# Altium schematic sheet Power Supply.SchDoc
size 381 x 241 mm
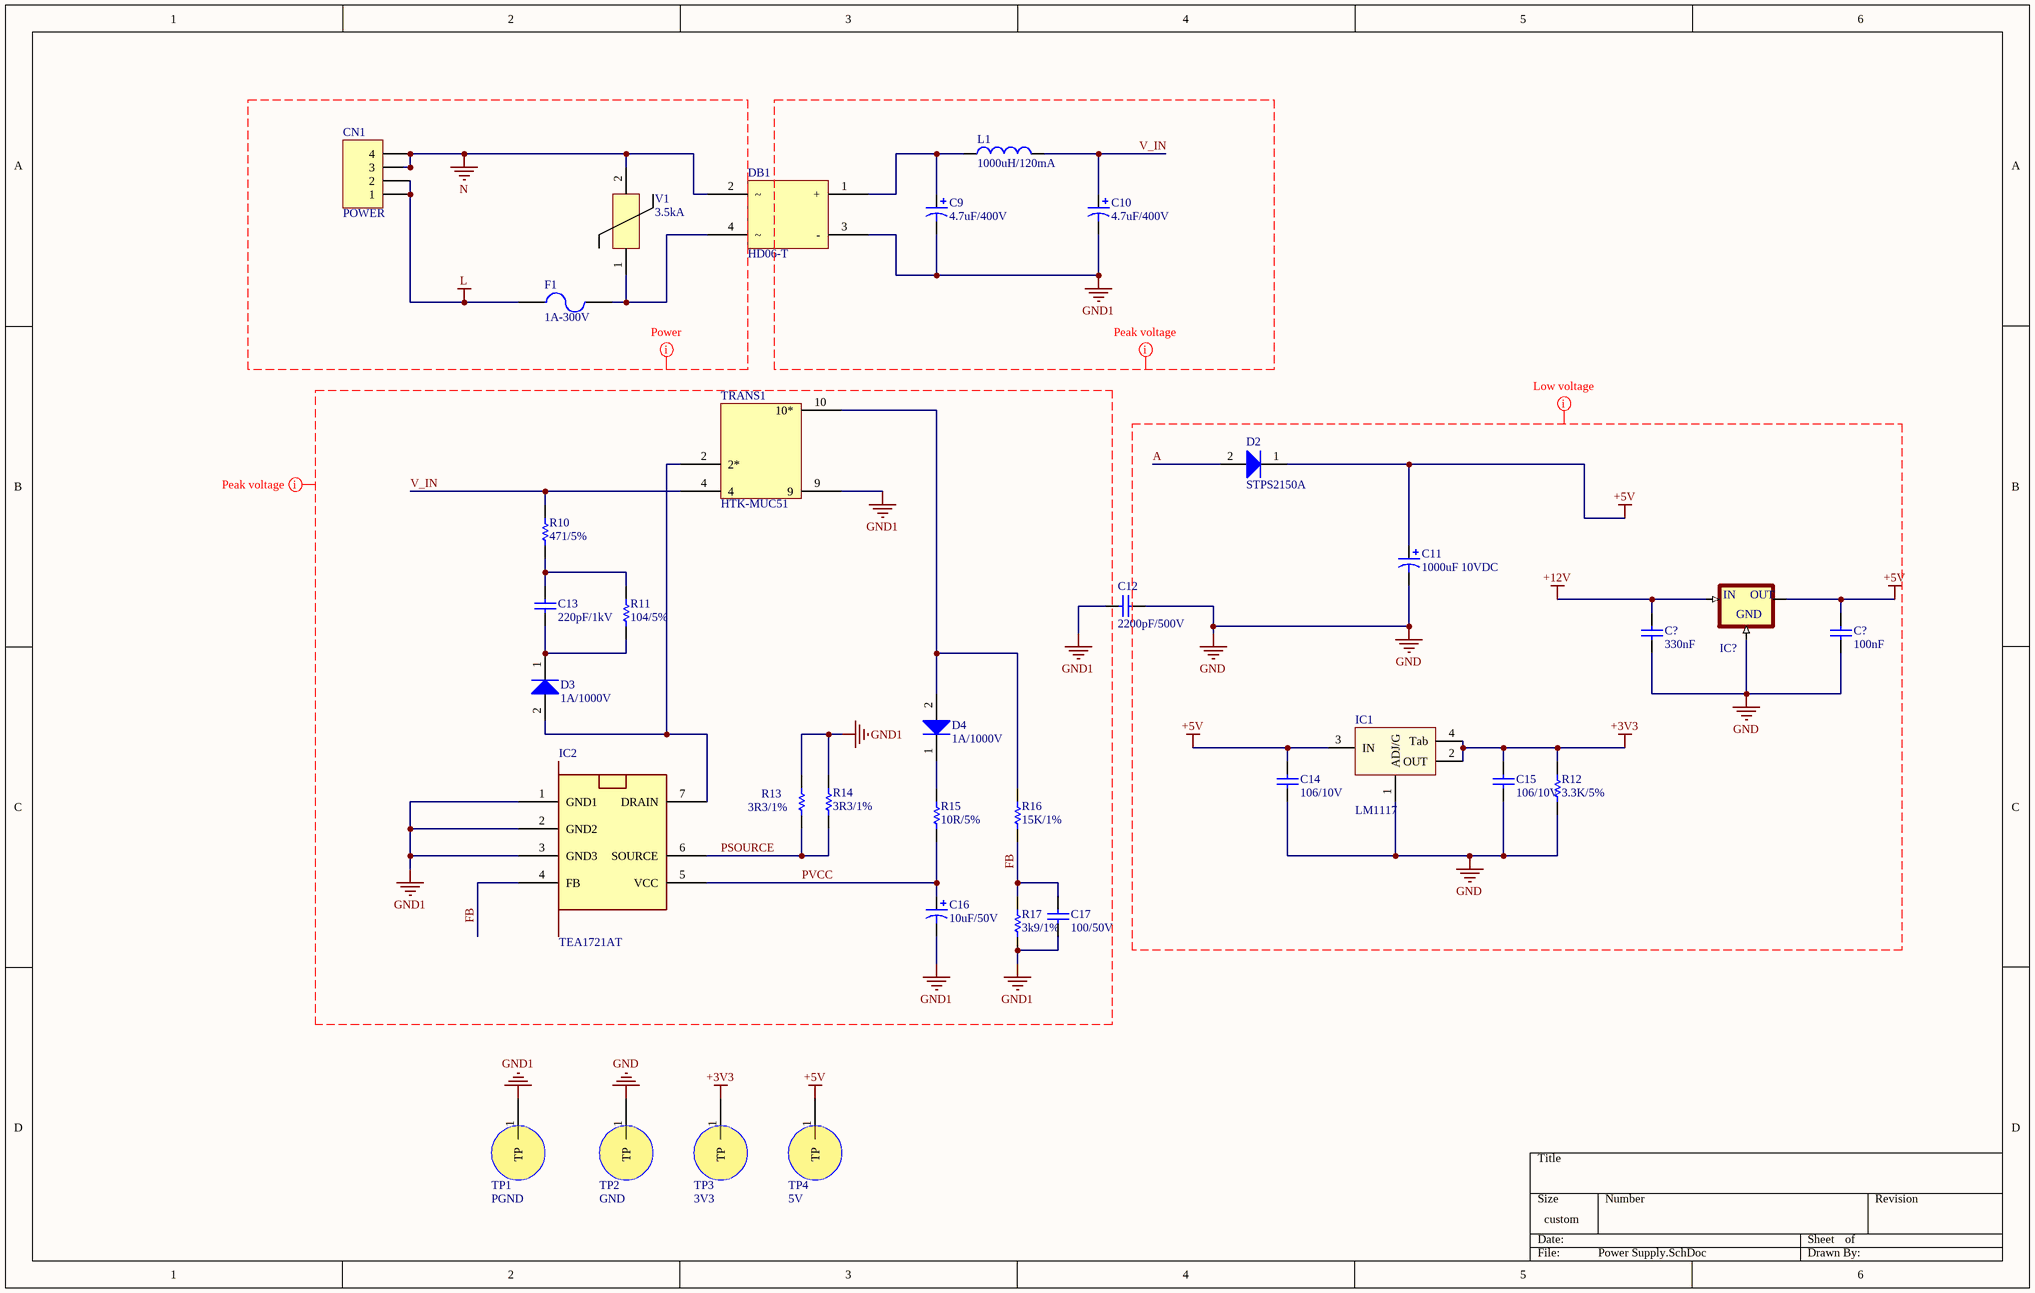
[diagram p0: Power Supply.SchDoc]

## Parts
(Parts that share a designator on the sheet are numbered #1, #2 ... from top to bottom, then left to right.)
C9  4.7uF/400V  [CAPPR3.5-8x11.5]
C10  4.7uF/400V  [CAPPR3.5-8x11.5]
C11  1000uF 10VDC  [CAPPR3.5-8x15A]
C12  2200pF/500V  [562R5TSD22]
C13  220pF/1kV  [F221K25Y5RN6UK5R]
C14  106/10V  [C0805-C]
C15  106/10V  [C0805-C]
C16  10uF/50V  [CAPPR2-5x11]
C17  100/50V  [C0603-C]
C?#1  330nF  [C0805-C]
C?#2  100nF  [C0805-C]
CN1  POWER  [H60200801000G]
D2  STPS2150A  [SMA]
D3  1A/1000V  [DO-214BA]
D4  1A/1000V  [DO-214BA]
DB1  HD06-T  [HD0X]
F1  1A-300V  [F36911000000]
IC1  LM1117  [SOT223-4N]
IC2  TEA1721AT  [SO-7]
IC?  78L05_TO252  [TO-263-3-A]  (value not drawn)
L1  1000uH/120mA  [RLB0812]
R10  471/5%  [R1206-C]
R11  104/5%  [R1206-C]
R12  3.3K/5%  [R0603-B]
R13  3R3/1%  [R1206-C]
R14  3R3/1%  [R1206-C]
R15  10R/5%  [R0603-B]
R16  15K/1%  [R0603-C]
R17  3k9/1%  [R0603-C]
TP1  PGND  [TP Multilayer]  (no BOM)
TP2  GND  [TP Multilayer]  (no BOM)
TP3  3V3  [TP Multilayer]  (no BOM)
TP4  5V  [TP Multilayer]  (no BOM)
TRANS1  HTK-MUC51  [HTK-MUC51]
V1  3.5kA  [V10E300P-H]

## Nets
+3V3: C15.2 IC1.2(OUT) IC1.4(Tab) R12.2 TP3.1(TP)
+5V: C11.1(+) C14.2 C?#2.2 D2.1(K) IC1.3(IN) IC?.3(OUT) TP4.1(TP)
+12V: C?#1.2 IC?.1(IN)
GND: C11.2(-) C12.2 C14.1 C15.1 C?#1.1 C?#2.1 IC1.1(ADJ/G) IC?.2(GND) R12.1 TP2.1(TP)
GND1: C9.2(-) C10.2(-) C12.1 C16.2(-) C17.1 DB1.3(-) IC2.1(GND1) IC2.2(GND2) IC2.3(GND3) R13.2 R14.2 R17.1 TP1.1(TP) TRANS1.9
L: CN1.1 CN1.2 F1.1
N: CN1.3 CN1.4 DB1.2 V1.2
A: D2.2(A)
FB: C17.2 IC2.4(FB) R16.1 R17.2
PSOURCE: IC2.6(SOURCE) R13.1 R14.1
PVCC: C16.1(+) IC2.5(VCC) R15.1
V_IN: C10.1(+) L1.2 R10.2 TRANS1.4
NetC9_1: C9.1(+) DB1.1(+) L1.1
NetC13_1: C13.1 D3.1(K) R11.1
NetC13_2: C13.2 R10.1 R11.2
NetD3_2: D3.2(A) IC2.7(DRAIN) TRANS1.2(2*)
NetD4_1: D4.1(K) R15.2
NetD4_2: D4.2(A) R16.2 TRANS1.10(10*)
NetDB1_4: DB1.4 F1.2 V1.1

## Layout directives
net class Peak voltage: FB, GND1, PSOURCE, PVCC, V_IN
net class Low voltage: +3V3, +5V, +12V, A, GND
net class Power: L, N

## Library data of the parts
C9 C10 = UVC2G4R7MPD: CAPP 4.7uF 400V 20%; BSH Partnumber: C-4.7-400-8x12; Manufacture: Nichicon; Pricing (USD): 0.196; Partnumber: UVC2G4R7MPD; Distributor: Mouser; Value: 4.7uF/400V; Creator: SmartDevice; Date: 20160610; ComponentLink1Description: Datasheet; ComponentLink1URL: http://www.mouser.com/ds/2/293/e-uvc-884169.pdf; Datasheet: http://www.mouser.com/ds/2/293/e-uvc-884169.pdf; ComponentLink2Description: Link sale; ComponentLink2URL: http://www.mouser.vn/ProductDetail/Nichicon/UVC2G4R7MPD/?qs=%2fha2pyFadugG8EgAuLk2FI4lDn3gTjIjspvzUlbO%2fdoUmPWf3U1vnw%3d%3d; Link sale: http://www.mouser.vn/ProductDetail/Nichicon/UVC2G4R7MPD/?qs=%2fha2pyFadugG8EgAuLk2FI4lDn3gTjIjspvzUlbO%2fdoUmPWf3U1vnw%3d%3d
C11 = EEU-FR1A102L: Aluminum Electrolytic Capacitors - Leaded 10VDC 1000uF 8x15mm LS3.5mm; BSH Partnumber: C-1000u-10V-20; Manufacture: Panasonic; Pricing (USD): 0; Partnumber: EEU-FR1A102L; Distributor: Mouser; Value: 1000uF 10VDC; Creator: NamNHc; Date: 20160709; ComponentLink1Description: Datasheet; ComponentLink1URL: http://www.mouser.com/ds/2/315/ABA0000C1021-947569.pdf; Datasheet: http://www.mouser.com/ds/2/315/ABA0000C1021-947569.pdf; ComponentLink2Description: Link sale; ComponentLink2URL: http://www.mouser.vn/ProductDetail/Panasonic/EEU-FR1A102L/?qs=sGAEpiMZZMtZ1n0r9vR22f2plZjWOZXTVY6dm5baXxU%3d; Link sale: http://www.mouser.vn/ProductDetail/Panasonic/EEU-FR1A102L/?qs=sGAEpiMZZMtZ1n0r9vR22f2plZjWOZXTVY6dm5baXxU%3d
C12 = 562R5TSD22: Ceramic Disc Capacitors 500volts 2200pF 10% .25LS X7R; BSH Partnumber: New part; Manufacture: Vishay / BC Components; Pricing (USD): 0.338; Partnumber: 562R5TSD22; Distributor: Mouser; Value: 2200pF/500V; Creator: NamNHc; Date: 20170329; ComponentLink1Description: Datasheet; ComponentLink1URL: http://www.mouser.com/ds/2/427/561r562r565r-239687.pdf; Datasheet: http://www.mouser.com/ds/2/427/561r562r565r-239687.pdf; ComponentLink2Description: Link sale; ComponentLink2URL: http://www.mouser.vn/ProductDetail/Vishay-Cera-Mite/562R5TSD22/?qs=sGAEpiMZZMt1mVBmZSXTPInczIyfF0EBuZvvR8HKRKI=; Link sale: http://www.mouser.vn/ProductDetail/Vishay-Cera-Mite/562R5TSD22/?qs=sGAEpiMZZMt1mVBmZSXTPInczIyfF0EBuZvvR8HKRKI=
C13 = F221K25Y5RN6UK5R: CAPP Ceramic Disc 220pF 1000V 10% 5x6.5mm; BSH Partnumber: C-220-1K-D; Manufacture: Vishay / BC Components; Pricing (USD): 0.129; Partnumber: F221K25Y5RN6UK5R; Distributor: Mouser; Value: 220pF/1kV; Creator: SmartDevice; Date: 20160716; ComponentLink1Description: Datasheet; ComponentLink1URL: http://www.mouser.com/ds/2/427/hvldf02-515169.pdf; Datasheet: http://www.mouser.com/ds/2/427/hvldf02-515169.pdf; ComponentLink2Description: Link sale; ComponentLink2URL: http://www.mouser.vn/ProductDetail/Vishay/F221K25Y5RN6UK5R/?qs=%2fha2pyFaduiH3AWr3oDgc4rr8ZI%252b6maFUN2U6TJgzO2VQGuikzFv0A%3d%3d; Link sale: http://www.mouser.vn/ProductDetail/Vishay/F221K25Y5RN6UK5R/?qs=%2fha2pyFaduiH3AWr3oDgc4rr8ZI%252b6maFUN2U6TJgzO2VQGuikzFv0A%3d%3d
C14 C15 = GRM21BR71A106KA73L: CAP 0805 10uF 10V 10%; BSH Partnumber: C-10u-10V-0805-10; Manufacture: Murata Electronics; Pricing (USD): 0.039; Partnumber: GRM21BR71A106KA73L; Distributor: Mouser; Value: 106/10V; Creator: SmartDevice; Date: 20160715; ComponentLink1Description: Datasheet; ComponentLink1URL: http://www.murata.com/products/catalog/pdf/c02e.pdf; Datasheet: http://www.murata.com/products/catalog/pdf/c02e.pdf; ComponentLink2Description: Link sale; ComponentLink2URL: http://www.mouser.vn/ProductDetail/Murata/GRM21BR71A106KA73L/?qs=%2fha2pyFaduh%2fEdsyu96AxlYmpb%2fkUgcA5NhpACNM6PnXP0Re01zvkhFjHxs1cDT4; Link sale: http://www.mouser.vn/ProductDetail/Murata/GRM21BR71A106KA73L/?qs=%2fha2pyFaduh%2fEdsyu96AxlYmpb%2fkUgcA5NhpACNM6PnXP0Re01zvkhFjHxs1cDT4
C16 = EEU-EB1H100S: CAPP 10uF 50V 20%; BSH Partnumber: C-10u-50-20-D; Manufacture: Panasonic; Pricing (USD): 0.072; Partnumber: EEU-EB1H100S; Distributor: Mouser; Value: 10uF/50V; Creator: SmartDevice; Date: 20160716; ComponentLink1Description: Datasheet; ComponentLink1URL: http://www.mouser.com/ds/2/315/DMF0000COL62-951366.pdf; Datasheet: http://www.mouser.com/ds/2/315/DMF0000COL62-951366.pdf; ComponentLink2Description: Link sale; ComponentLink2URL: http://www.mouser.vn/ProductDetail/Panasonic/EEU-EB1H100S/?qs=sGAEpiMZZMtZ1n0r9vR22RyzzjEKRzqKZbIP%252bqQ6oFI%3d; Link sale: http://www.mouser.vn/ProductDetail/Panasonic/EEU-EB1H100S/?qs=sGAEpiMZZMtZ1n0r9vR22RyzzjEKRzqKZbIP%252bqQ6oFI%3d
C17 = GRM1885C1H100JA01D: CAP 0603 10pF 5% 50V; BSH Partnumber: C-100-50-0603-5; Manufacture: Murata Electronics; Pricing (USD): 0.01; Partnumber: GRM1885C1H100JA01D; Distributor: Mouser; Value: 100/50V; Creator: SmartDevice; Date: 20160715; ComponentLink1Description: Datasheet; ComponentLink1URL: http://www.murata.com/products/catalog/pdf/c02e.pdf; Datasheet: http://www.murata.com/products/catalog/pdf/c02e.pdf; ComponentLink2Description: Link sale; ComponentLink2URL: http://www.mouser.vn/ProductDetail/Murata/GRM1885C1H100JA01D/?qs=%2fha2pyFadug%2fvrC4VCXnlbJmrOFMaxj30QUgA6YXUVlxuM%2fhvX8xlA%3d%3d; Link sale: http://www.mouser.vn/ProductDetail/Murata/GRM1885C1H100JA01D/?qs=%2fha2pyFadug%2fvrC4VCXnlbJmrOFMaxj30QUgA6YXUVlxuM%2fhvX8xlA%3d%3d
C?#1 C?#2 = GRM21BR71A106KA73L: CAP 0805 10uF 10V 10%; BSH Partnumber: C-10u-10V-0805-10; Manufacture: Murata Electronics; Value: 106/10V; Pricing (USD): 0.039; Partnumber: GRM21BR71A106KA73L; Distributor: Mouser; Creator: SmartDevice; Date: 20160715; ComponentLink1Description: Datasheet; ComponentLink1URL: http://www.murata.com/products/catalog/pdf/c02e.pdf; Datasheet: http://www.murata.com/products/catalog/pdf/c02e.pdf; ComponentLink2Description: Link sale; ComponentLink2URL: http://www.mouser.vn/ProductDetail/Murata/GRM21BR71A106KA73L/?qs=%2fha2pyFaduh%2fEdsyu96AxlYmpb%2fkUgcA5NhpACNM6PnXP0Re01zvkhFjHxs1cDT4; Link sale: http://www.mouser.vn/ProductDetail/Murata/GRM21BR71A106KA73L/?qs=%2fha2pyFaduh%2fEdsyu96AxlYmpb%2fkUgcA5NhpACNM6PnXP0Re01zvkhFjHxs1cDT4
CN1 = H60200801000G: CON H60200801000G 4P Male; BSH Partnumber: CN-H60200801000G; Manufacture: ANYTEK; Value: CON-4; Partnumber: H60200801000G; Creator: SmartDevice; Date: 20160715; ComponentLink1Description: Datasheet; ComponentLink1URL: http://www.anytek.com.tw/UserUpFiles/20120827/QEmQqqk9rR3n.pdf; Datasheet: http://www.anytek.com.tw/UserUpFiles/20120827/QEmQqqk9rR3n.pdf; ComponentLink2Description: Link sale; ComponentLink2URL: http://www.anytek.com.tw/EN/search_product.aspx?cateid=&codename=&exflag1=0&exflag5=60200801000G&page=1; Link sale: http://www.anytek.com.tw/EN/search_product.aspx?cateid=&codename=&exflag1=0&exflag5=60200801000G&page=1
D2 = STPS2150A: DIODE SMA 2.0A 150V 2.95x4.6x2.03mm; BSH Partnumber: D-STPS2150A; Manufacture: STMicroelectronics; Pricing (USD): 0.155; Partnumber: STPS2150A; Distributor: Mouser; Value: STPS2150A; Creator: SmartDevice; Date: 20160610; ComponentLink1Description: Datasheet; ComponentLink1URL: http://www.mouser.com/ds/2/389/CD00003322-250509.pdf; Datasheet: http://www.mouser.com/ds/2/389/CD00003322-250509.pdf; ComponentLink2Description: Link sale; ComponentLink2URL: http://www.mouser.vn/ProductDetail/STMicroelectronics/STPS2150A/?qs=%2fha2pyFadugOUJO7vR3gGVErv5AK1AyP3XR3TiacJmw%3d; Link sale: http://www.mouser.vn/ProductDetail/STMicroelectronics/STPS2150A/?qs=%2fha2pyFadugOUJO7vR3gGVErv5AK1AyP3XR3TiacJmw%3d
D3 D4 = GF1M-E3/67A: DIODE DO-214AB 1000V 1A; BSH Partnumber: D-GF1M; Manufacture: Vishay Semiconductors; Pricing (USD): 0.187; Partnumber: GF1M-E3/67A; Distributor: Mouser; Value: 1A/1000V; Creator: SmartDevice; Date: 20151022; ComponentLink1Description: Datasheet; ComponentLink1URL: http://www.mouser.com/ds/2/427/gf1-240444.pdf; Datasheet: http://www.mouser.com/ds/2/427/gf1-240444.pdf; ComponentLink2Description: Link sale; ComponentLink2URL: http://vn.mouser.com/ProductDetail/Vishay-Semiconductors/GF1M-E3-67A/?qs=AvlKB63p5SmLpodxku2zLQ%3D%3D; Link sale: http://vn.mouser.com/ProductDetail/Vishay-Semiconductors/GF1M-E3-67A/?qs=AvlKB63p5SmLpodxku2zLQ%3D%3D
DB1 = HD06-T: DB SMD 0.8A 600V; BSH Partnumber: D-HD06-T; Manufacture: Diodes Incorporated; Pricing (USD): 0.151; Partnumber: HD06-T; Distributor: Mouser; Value: HD06-T; Creator: SmartDevice; Date: 20160704; ComponentLink1Description: Datasheet; ComponentLink1URL: http://www.mouser.com/ds/2/115/ds17003-38038.pdf; Datasheet: http://www.mouser.com/ds/2/115/ds17003-38038.pdf; ComponentLink2Description: Link sale; ComponentLink2URL: http://www.mouser.vn/ProductDetail/Diodes-Incorporated/HD06-T/?qs=sGAEpiMZZMtQ8nqTKtFS%2fNgL6ac11fJuElzuDV0ZOyo%3d; Link sale: http://www.mouser.vn/ProductDetail/Diodes-Incorporated/HD06-T/?qs=sGAEpiMZZMtQ8nqTKtFS%2fNgL6ac11fJuElzuDV0ZOyo%3d
F1 = 36911000000: FUSE 36911000000 1A 300V 4x8mm; BSH Partnumber: F-1A-300V; Manufacture: Little Fuse; Pricing (USD): 0.212; Partnumber: 36911000000; Distributor: Mouser; Value: 1A-300V; Creator: SmartDevice; Date: 20160611; ComponentLink1Description: Datasheet; ComponentLink1URL: http://www.mouser.com/ds/2/240/Littelfuse_Fuse_369_Datasheet.pdf-693406.pdf; Datasheet: http://www.mouser.com/ds/2/240/Littelfuse_Fuse_369_Datasheet.pdf-693406.pdf; ComponentLink2Description: Link sale; ComponentLink2URL: http://www.mouser.vn/ProductDetail/Littelfuse/36911000000/?qs=%2fha2pyFadugel56iQkHFpKBlKzqe72eQ8PsAjO18UxxK9Xd8%252bW4Qpg%3d%3d; Link sale: http://www.mouser.vn/ProductDetail/Littelfuse/36911000000/?qs=%2fha2pyFadugel56iQkHFpKBlKzqe72eQ8PsAjO18UxxK9Xd8%252bW4Qpg%3d%3d
IC1 = LM1117: 3v3; Value: LM317
IC2 = TEA1721AT/N1,118: IC AC/DC Converter SO-7 5.0x6.2x1.75mm; BSH Partnumber: IC-TEA1721AT/N1,118; Manufacture: NXP; Pricing (USD): 1; Partnumber: TEA1721AT/N1,118; Distributor: Mouser; Value: TEA1721AT; Creator: SmartDevice; Date: 20160611; ComponentLink1Description: Datasheet; ComponentLink1URL: http://www.mouser.com/ds/2/302/TEA1721AT-843077.pdf; Datasheet: http://www.mouser.com/ds/2/302/TEA1721AT-843077.pdf; ComponentLink2Description: Link sale; ComponentLink2URL: http://www.mouser.vn/ProductDetail/NXP/TEA1721AT-N1118/?qs=%2fha2pyFadujS%2fIwLEty%2falDzm3J8%2fJUNkB0iVdfNz8M%3d; Link sale: http://www.mouser.vn/ProductDetail/NXP/TEA1721AT-N1118/?qs=%2fha2pyFadujS%2fIwLEty%2falDzm3J8%2fJUNkB0iVdfNz8M%3d
IC? = 78L05_TO252: 78L05
L1 = RLB0812-102KL: IND  1000uH 10% 0.12A; BSH Partnumber: L-RLB0812-102KL; Manufacture: Bourns; Pricing (USD): 0.116; Partnumber: RLB0812-102KL; Distributor: Mouser; Value: 1000uH/120mA; Creator: SmartDevice; Date: 20160707; ComponentLink1Description: Datasheet; ComponentLink1URL: http://www.mouser.com/ds/2/54/LB-777833.pdf; Datasheet: http://www.mouser.com/ds/2/54/LB-777833.pdf; ComponentLink2Description: Link sale; ComponentLink2URL: http://www.mouser.vn/ProductDetail/Bourns/RLB0812-102KL/?qs=%2fha2pyFadugUXycZP3hAKbNHRNMcV3vYTNoRX6lu328P8PrVdgjsIA%3d%3d; Link sale: http://www.mouser.vn/ProductDetail/Bourns/RLB0812-102KL/?qs=%2fha2pyFadugUXycZP3hAKbNHRNMcV3vYTNoRX6lu328P8PrVdgjsIA%3d%3d
R10 = RC1206JR-07470RL: RES 1206 470R 5% 250mW; BSH Partnumber: R-470R-1206-5; Manufacture: Yageo; Pricing (USD): 0.004; Partnumber: RC1206JR-07470RL; Distributor: Mouser; Value: 471/5%; Creator: SmartDevice; Date: 20160716; ComponentLink1Description: Datasheet; ComponentLink1URL: http://www.mouser.com/ds/2/447/PYu-RC1206_51_RoHS_L-4-349080.pdf; Datasheet: http://www.mouser.com/ds/2/447/PYu-RC1206_51_RoHS_L-4-349080.pdf; ComponentLink2Description: Link sale; ComponentLink2URL: http://www.mouser.vn/ProductDetail/Yageo/RC1206JR-07470RL/?qs=%2fha2pyFadugAv10W5eASAinpIUt6qtrVv1pLdKpZoto0rQMznlyYjg%3d%3d; Link sale: http://www.mouser.vn/ProductDetail/Yageo/RC1206JR-07470RL/?qs=%2fha2pyFadugAv10W5eASAinpIUt6qtrVv1pLdKpZoto0rQMznlyYjg%3d%3d
R11 = RC1206JR-07100KL: RES 1206 100K 5% 250mW; BSH Partnumber: R-100K-1206-5; Manufacture: Yageo; Pricing (USD): 0.004; Partnumber: RC1206JR-07100KL; Distributor: Mouser; Value: 104/5%; Creator: SmartDevice; Date: 20160716; ComponentLink1Description: Datasheet; ComponentLink1URL: http://www.mouser.com/ds/2/447/PYu-RC1206_51_RoHS_L-4-349080.pdf; Datasheet: http://www.mouser.com/ds/2/447/PYu-RC1206_51_RoHS_L-4-349080.pdf; ComponentLink2Description: Link sale; ComponentLink2URL: http://www.mouser.vn/ProductDetail/Yageo/RC1206JR-07100KL/?qs=%2fha2pyFadugAv10W5eASAgAbIwDj0mC5zdBHJsZxIFkHK6MBmZ2tew%3d%3d; Link sale: http://www.mouser.vn/ProductDetail/Yageo/RC1206JR-07100KL/?qs=%2fha2pyFadugAv10W5eASAgAbIwDj0mC5zdBHJsZxIFkHK6MBmZ2tew%3d%3d
R12 = RC0603JR-073K3L: RES 0603 3.3K 5% 100mW; BSH Partnumber: R-3K3-0603-5; Manufacture: Yageo; Pricing (USD): 0.002; Partnumber: RC0603JR-073K3L; Distributor: Mouser; Value: 3.3K/5%; Creator: SmartDevice; Date: 20160716; ComponentLink1Description: Datasheet; ComponentLink1URL: http://www.mouser.com/ds/2/447/RC0603-272842.pdf; Datasheet: http://www.mouser.com/ds/2/447/RC0603-272842.pdf; ComponentLink2Description: Link sale; ComponentLink2URL: http://www.mouser.vn/ProductDetail/Yageo/RC0603JR-073K3L/?qs=%2fha2pyFaduiI%252b%2f%2fp%2fYhTTUC9G%2ftM89tiss13Vr5bentGgwH5efyYUg%3d%3d; Link sale: http://www.mouser.vn/ProductDetail/Yageo/RC0603JR-073K3L/?qs=%2fha2pyFaduiI%252b%2f%2fp%2fYhTTUC9G%2ftM89tiss13Vr5bentGgwH5efyYUg%3d%3d
R13 R14 = RC1206FR-073R3L: RES 1206 3R3 1% 250mW; BSH Partnumber: R-3R3-1206-1; Manufacture: Yageo; Pricing (USD): 0.009; Partnumber: RC1206FR-073R3L; Distributor: Mouser; Value: 3R3/1%; Creator: SmartDevice; Date: 20160716; ComponentLink1Description: Datasheet; ComponentLink1URL: http://www.mouser.com/ds/2/447/PYu-RC1206_51_RoHS_L-4-349080.pdf; Datasheet: http://www.mouser.com/ds/2/447/PYu-RC1206_51_RoHS_L-4-349080.pdf; ComponentLink2Description: Link sale; ComponentLink2URL: http://www.mouser.vn/ProductDetail/Yageo/RC1206FR-073R3L/?qs=%2fha2pyFaduhRUg1%252bSfBETOq42wV2vAUJY3MnS0bXa6FiCpwrrcH8OQ%3d%3d; Link sale: http://www.mouser.vn/ProductDetail/Yageo/RC1206FR-073R3L/?qs=%2fha2pyFaduhRUg1%252bSfBETOq42wV2vAUJY3MnS0bXa6FiCpwrrcH8OQ%3d%3d
R15 = RC0603JR-0710RL: RES 0603 10R 5% 100mW; BSH Partnumber: R-10R-0603-5; Manufacture: Yageo; Pricing (USD): 0.002; Partnumber: RC0603JR-0710RL; Distributor: Mouser; Value: 10R/5%; Creator: SmartDevice; Date: 20150818; ComponentLink1Description: Datasheet; ComponentLink1URL: http://www.mouser.com/ds/2/447/RC0603-272842.pdf; Datasheet: http://www.mouser.com/ds/2/447/RC0603-272842.pdf; ComponentLink2Description: Link sale; ComponentLink2URL: http://vn.mouser.com/ProductDetail/Yageo/RC0603JR-0710RL/?qs=sGAEpiMZZMu61qfTUdNhG5eFuApKbqVd7N2n6WR6Q2s%3d; Link sale: http://vn.mouser.com/ProductDetail/Yageo/RC0603JR-0710RL/?qs=sGAEpiMZZMu61qfTUdNhG5eFuApKbqVd7N2n6WR6Q2s%3d
R16 = RC0603FR-0715KL: RES 0603 15k 1% 100mW; BSH Partnumber: R-15K-0603-1; Manufacture: Yageo; Pricing (USD): 0.002; Partnumber: RC0603FR-0715KL; Distributor: Mouser; Value: 15K/1%; Creator: SmartDevice; Date: 20160716; ComponentLink1Description: Datasheet; ComponentLink1URL: http://www.mouser.com/ds/2/447/RC0603-272842.pdf; Datasheet: http://www.mouser.com/ds/2/447/RC0603-272842.pdf; ComponentLink2Description: Link sale; ComponentLink2URL: http://www.mouser.vn/ProductDetail/Yageo/RC0603FR-0715KL/?qs=%2fha2pyFaduhXXNW8qwNUNlRLrWlOrSb86bYDLRXgp06KHZvTB0LjtA%3d%3d; Link sale: http://www.mouser.vn/ProductDetail/Yageo/RC0603FR-0715KL/?qs=%2fha2pyFaduhXXNW8qwNUNlRLrWlOrSb86bYDLRXgp06KHZvTB0LjtA%3d%3d
R17 = RC0603FR-073K9L: RES 0603 3K9 1% 100mW; BSH Partnumber: R-3K9-0603-1; Manufacture: Yageo; Pricing (USD): 0.0013; Partnumber: RC0603FR-073K9L; Distributor: Digikey; Value: 3k9/1%; Creator: SmartDevice; Date: 20160714; ComponentLink1Description: Datasheet; ComponentLink1URL: http://www.yageo.com.tw/exep/pages/download/literatures/PYu-R_INT-thick_7.pdf; Datasheet: http://www.yageo.com.tw/exep/pages/download/literatures/PYu-R_INT-thick_7.pdf; ComponentLink2Description: Link sale; ComponentLink2URL: http://www.digikey.com/product-detail/en/yageo/RC0603FR-073K9L/311-3.90KHRTR-ND/727136; Link sale: http://www.digikey.com/product-detail/en/yageo/RC0603FR-073K9L/311-3.90KHRTR-ND/727136
TP1-TP4 = TP1: Test Point Multilayer; Partnumber: TP1; Value: TP Multilayer; BSH Partnumber: TP; Creator: DucNTc; Date: 20150912; ComponentLink1Description: Datasheet; ComponentLink2Description: Link sale
TRANS1 = HTK-MUC51: Transformer 5V/1A Power; BSH Partnumber: T-HTK-MUC51; Manufacture: Tabuchi electric; Value: TRANS; Pricing (USD): 2; Partnumber: HTK-MUC51; Distributor: Tabuchi Viet Nam; Creator: NamNHc; Date: 20160614; ComponentLink1Description: Datasheet; ComponentLink2Description: Link sale
V1 = V10E300P: Varistors 300V 10mm Epoxy UltraMOV; BSH Partnumber: New part; Manufacture: Little Fuse; Pricing (USD): 0.161; Partnumber: V10E300P; Distributor: Mouser; Value: 3.5kA; Creator: NamNHc; Date: 20170329; ComponentLink1Description: Datasheet; ComponentLink1URL: http://www.mouser.com/ds/2/240/Littelfuse_MOV_UltraMOV-67928.pdf; Datasheet: http://www.mouser.com/ds/2/240/Littelfuse_MOV_UltraMOV-67928.pdf; ComponentLink2Description: Link sale; ComponentLink2URL: http://www.mouser.vn/ProductDetail/Littelfuse/V10E300P/?qs=sGAEpiMZZMuQmL5N8IqpX830%2f%252b2kYIgxyGDqkDiNBrs%3d; Link sale: http://www.mouser.vn/ProductDetail/Littelfuse/V10E300P/?qs=sGAEpiMZZMuQmL5N8IqpX830%2f%252b2kYIgxyGDqkDiNBrs%3d